# Altium schematic sheet Titanium_v0.1.SchDoc
size A3
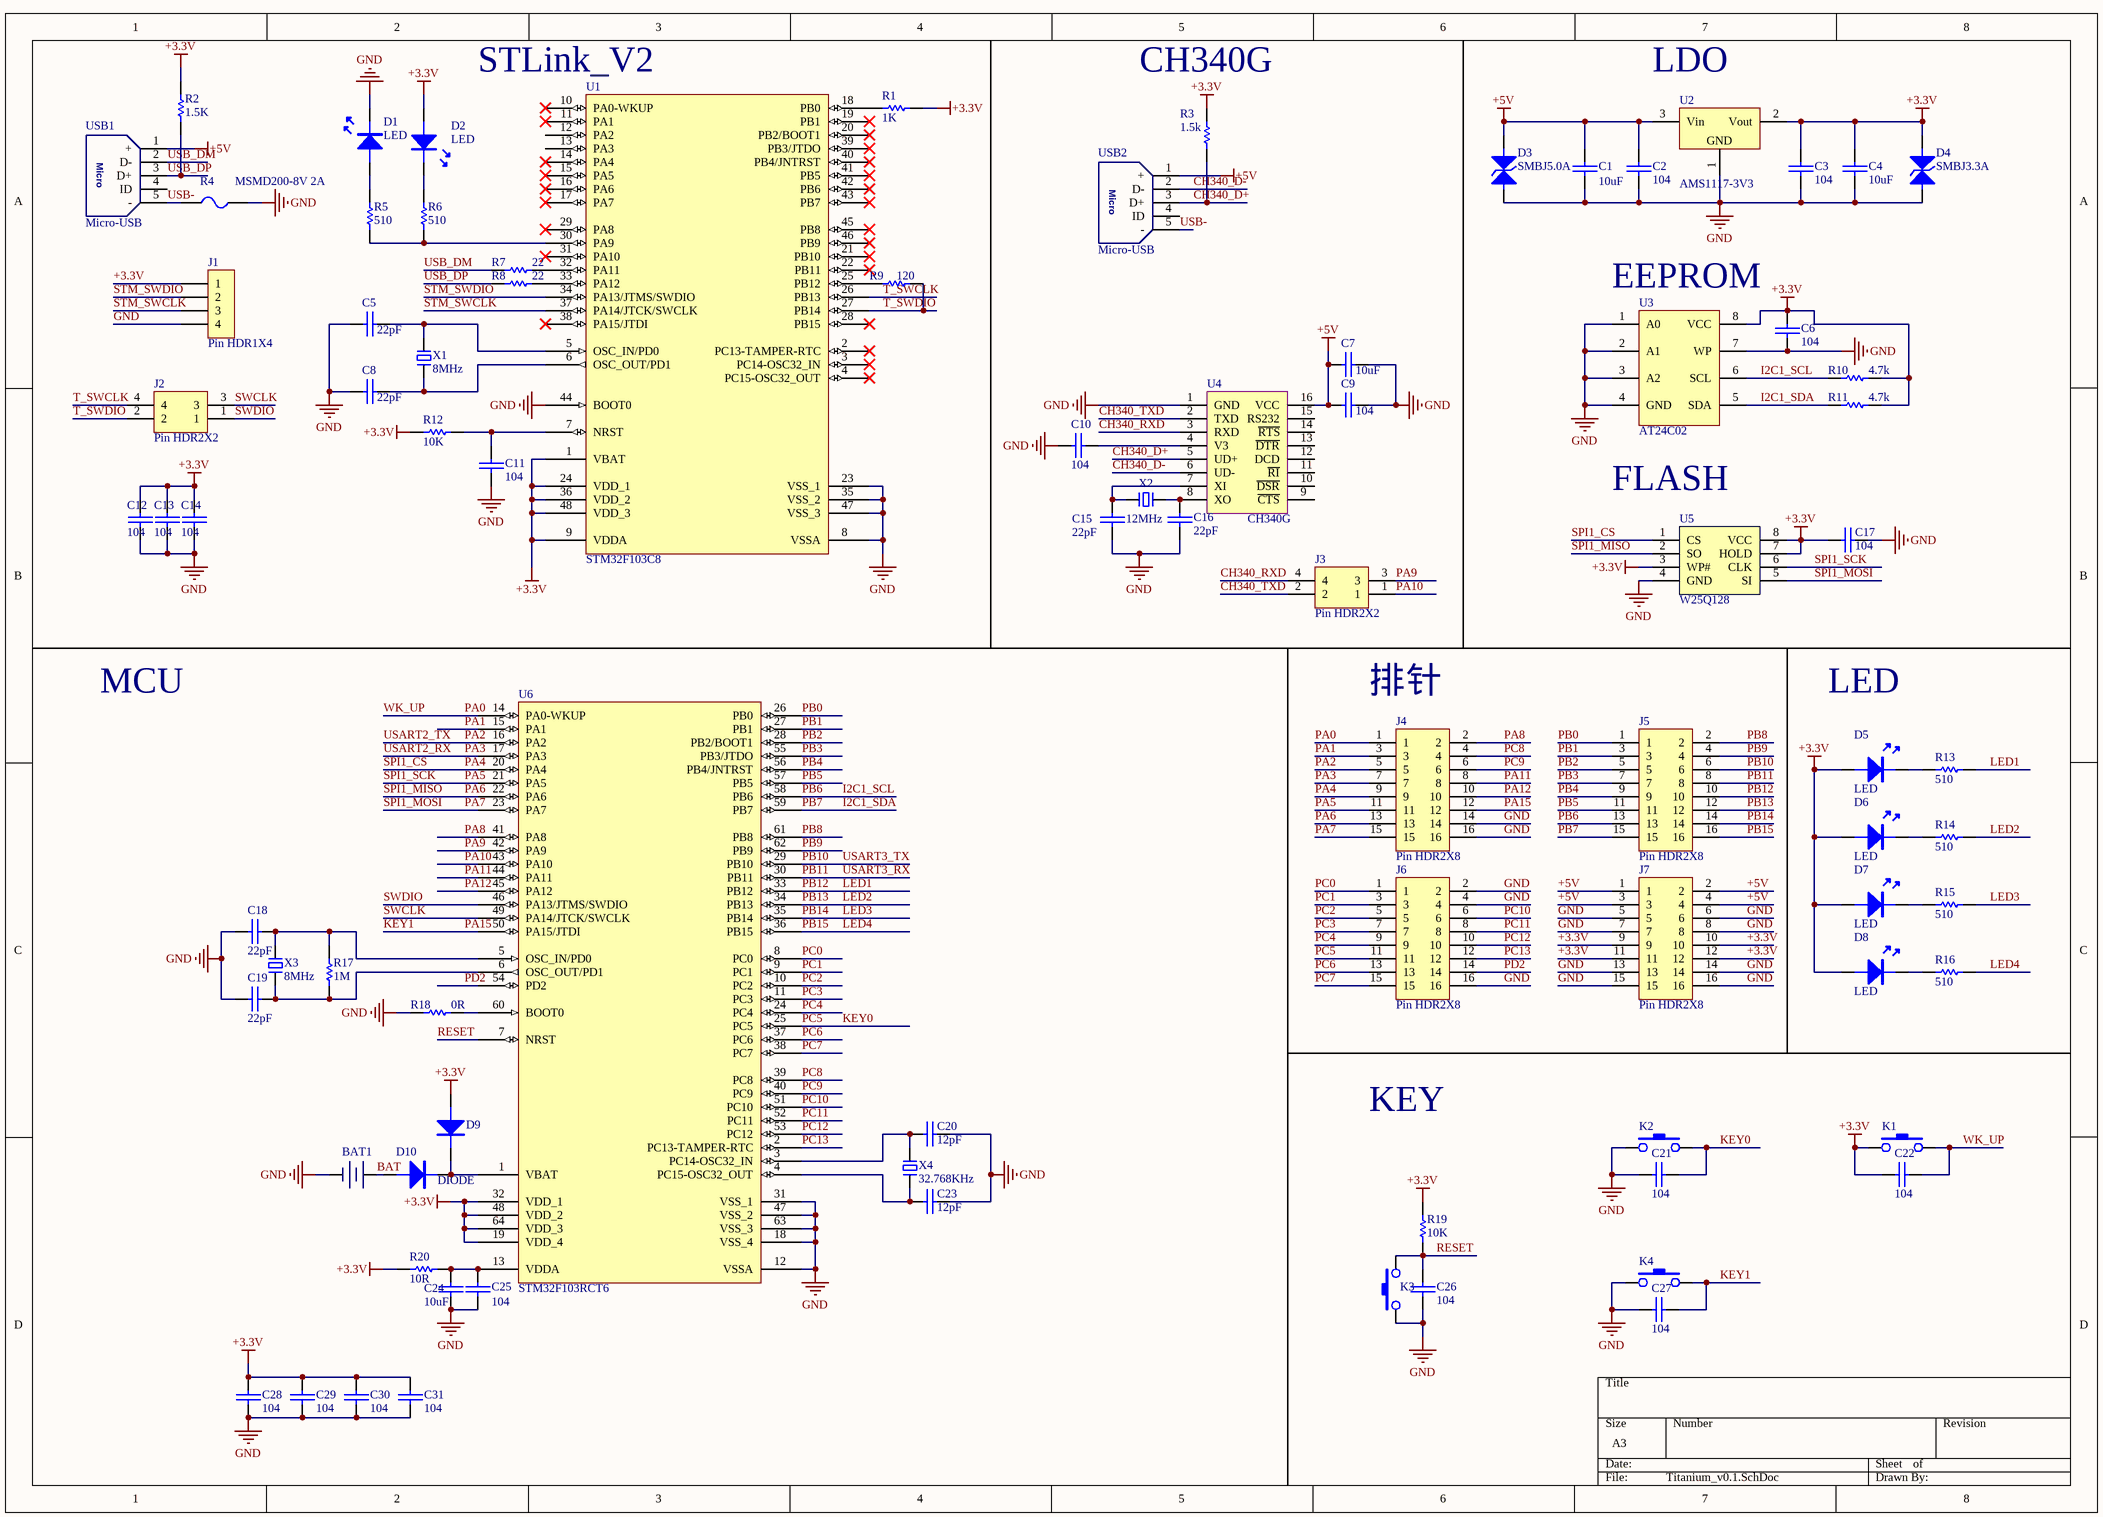
[diagram p0: Titanium_v0.1.SchDoc]

## Parts
BAT1  CR1220  [CR1220-A]  (value not drawn)
C1  10uF  [1210C]
C2  104  [0603C]
C3  104  [0603C]
C4  10uF  [1210C]
C5  22pF  [0603C]
C6  104  [0603C]
C7  10uF  [0603C]
C8  22pF  [0603C]
C9  104  [0603C]
C10  104  [0603C]
C11  104  [0603C]
C12  104  [0603C]
C13  104  [0603C]
C14  104  [0603C]
C15  22pF  [0603C]
C16  22pF  [0603C]
C17  104  [0603C]
C18  22pF  [0603C]
C19  22pF  [0603C]
C20  12pF  [0603C]
C21  104  [0603C]
C22  104  [0603C]
C23  12pF  [0603C]
C24  10uF  [0603C]
C25  104  [0603C]
C26  104  [0603C]
C27  104  [0603C]
C28  104  [0603C]
C29  104  [0603C]
C30  104  [0603C]
C31  104  [0603C]
D1  LED  [LED-0603B]
D2  LED  [LED-0603B]
D3  SMBJ5.0A  [SMB/DO-214AA]
D4  SMBJ3.3A  [SMB/DO-214AA]
D5  LED  [LED-0603B]
D6  LED  [LED-0603B]
D7  LED  [LED-0603B]
D8  LED  [LED-0603B]
D9  DIODE  [LL34]  (value not drawn)
D10  DIODE  [LL34]
J1  Pin HDR1X4  [Pin HDR1X4/2.54mm-S]
J2  Pin HDR2X2  [Pin HDR2X2/2.54mm-S]
J3  Pin HDR2X2  [Pin HDR2X2/2.54mm-S]
J4  Pin HDR2X8  [Pin HDR2X8/2.54mm-S]
J5  Pin HDR2X8  [Pin HDR2X8/2.54mm-S]
J6  Pin HDR2X8  [Pin HDR2X8/2.54mm-S]
J7  Pin HDR2X8  [Pin HDR2X8/2.54mm-S]
K1  KEY  [DIP-6X6X5]  (value not drawn)
K2  KEY  [DIP-6X6X5]  (value not drawn)
K3  KEY  [DIP-6X6X5]  (value not drawn)
K4  KEY  [DIP-6X6X5]  (value not drawn)
R1  1K  [0603R]
R2  1.5K  [0603R]
R3  1.5k  [0603R]
R4  MSMD200-8V 2A  [0805R]
R5  510  [0603R]
R6  510  [0603R]
R7  22  [0603R]
R8  22  [0603R]
R9  120  [0603R]
R10  4.7k  [0603R]
R11  4.7k  [0603R]
R12  10K  [0603R]
R13  510  [0603R]
R14  510  [0603R]
R15  510  [0603R]
R16  510  [0603R]
R17  1M  [0603R]
R18  0R  [0603R]
R19  10K  [0603R]
R20  10R  [0603R]
U1  STM32F103C8  [LQFP48 7X7]
U2  AMS1117-3V3  [SOT89]
U3  AT24C02  [SOP8]
U4  CH340G  [SOP16]
U5  W25Q128  [SOIC8]
U6  STM32F103RCT6  [LQFP64 10x10]
USB1  Micro-USB  [USB-MICRO_A]
USB2  Micro-USB  [USB-MICRO_A]
X1  8MHz  [OSC 5032-2P]
X2  12MHz  [OSC HC-49SMD]
X3  8MHz  [OSC 5032-2P]
X4  32.768KHz  [OSC 3215-2P]

## Nets
+3.3V: C3.2 C4.2 C6.2 C12.1 C13.1 C14.1 C17.2 C22.1 C28.2 C29.2 C30.2 C31.2 D2.A D4.K D5.A D6.A D7.A D8.A D9.A J1.1 J7.9 J7.10 J7.11 J7.12 K1.1 R1.2 R2.2 R3.1 R10.2 R11.2 R12.1 R19.2 R20.1 U1.1(VBAT) U1.9(VDDA) U1.24(VDD_1) U1.36(VDD_2) U1.48(VDD_3) U2.2(Vout) U3.8(VCC) U5.3(WP#) U5.7(HOLD) U5.8(VCC) U6.19(VDD_4) U6.32(VDD_1) U6.48(VDD_2) U6.64(VDD_3)
+5V: C1.2 C2.2 C7.2 C9.2 D3.K J7.1 J7.2 J7.3 J7.4 U2.3(Vin) U4.16(VCC) USB1.1(+) USB2.1(+)
GND: BAT1.2 C1.1 C2.1 C3.1 C4.1 C5.2 C6.1 C7.1 C8.2 C9.1 C10.2 C11.2 C12.2 C13.2 C14.2 C15.1 C16.1 C17.1 C18.1 C19.1 C20.1 C21.1 C23.1 C24.1 C25.1 C26.1 C27.1 C28.1 C29.1 C30.1 C31.1 D1.K D3.A D4.A J1.4 J4.14 J4.16 J6.2 J6.4 J6.16 J7.5 J7.6 J7.7 J7.8 J7.13 J7.14 J7.15 J7.16 K2.1 K3.1 K4.1 R4.2 R18.1 U1.8(VSSA) U1.23(VSS_1) U1.35(VSS_2) U1.44(BOOT0) U1.47(VSS_3) U2.1(GND) U3.1(A0) U3.2(A1) U3.3(A2) U3.4(GND) U3.7(WP) U4.1(GND) U5.4(GND) U6.12(VSSA) U6.18(VSS_4) U6.31(VSS_1) U6.47(VSS_2) U6.63(VSS_3)
BAT: BAT1.1 D10.A
CH340_D+: R3.2 U4.5(UD+) USB2.3(D+)
CH340_D-: U4.6(UD-) USB2.2(D-)
CH340_RXD: J3.4 U4.3(RXD)
CH340_TXD: J3.2 U4.2(TXD)
I2C1_SCL: J5.13 R10.1 U3.6(SCL) U6.58(PB6)  [also labelled PB6]
I2C1_SDA: J5.15 R11.1 U3.5(SDA) U6.59(PB7)  [also labelled PB7]
KEY0: C21.2 J6.11 K2.3 U6.25(PC5)  [also labelled PC5]
KEY1: C27.2 J4.12 K4.3 U6.50(PA15/JTDI)  [also labelled PA15]
LED1: J5.10 R13.2 U6.33(PB12)  [also labelled PB12]
LED2: J5.12 R14.2 U6.34(PB13)  [also labelled PB13]
LED3: J5.14 R15.2 U6.35(PB14)  [also labelled PB14]
LED4: J5.16 R16.2 U6.36(PB15)  [also labelled PB15]
PA0: C22.2 J4.1 K1.3 U6.14(PA0-WKUP)  [also labelled WK_UP]
PA1: J4.3 U6.15(PA1)
PA2: J4.5 U6.16(PA2)  [also labelled USART2_TX]
PA3: J4.7 U6.17(PA3)  [also labelled USART2_RX]
PA4: J4.9 U5.1(CS) U6.20(PA4)  [also labelled SPI1_CS]
PA5: J4.11 U5.6(CLK) U6.21(PA5)  [also labelled SPI1_SCK]
PA6: J4.13 U5.2(SO) U6.22(PA6)  [also labelled SPI1_MISO]
PA7: J4.15 U5.5(SI) U6.23(PA7)  [also labelled SPI1_MOSI]
PA8: J4.2 U6.41(PA8)
PA9: J3.3 U6.42(PA9)
PA10: J3.1 U6.43(PA10)
PA11: J4.8 U6.44(PA11)
PA12: J4.10 U6.45(PA12)
PB0: J5.1 U6.26(PB0)
PB1: J5.3 U6.27(PB1)
PB2: J5.5 U6.28(PB2/BOOT1)
PB3: J5.7 U6.55(PB3/JTDO)
PB4: J5.9 U6.56(PB4/JNTRST)
PB5: J5.11 U6.57(PB5)
PB8: J5.2 U6.61(PB8)
PB9: J5.4 U6.62(PB9)
PB10: J5.6 U6.29(PB10)  [also labelled USART3_TX]
PB11: J5.8 U6.30(PB11)  [also labelled USART3_RX]
PC0: J6.1 U6.8(PC0)
PC1: J6.3 U6.9(PC1)
PC2: J6.5 U6.10(PC2)
PC3: J6.7 U6.11(PC3)
PC4: J6.9 U6.24(PC4)
PC6: J6.13 U6.37(PC6)
PC7: J6.15 U6.38(PC7)
PC8: J4.4 U6.39(PC8)
PC9: J4.6 U6.40(PC9)
PC10: J6.6 U6.51(PC10)
PC11: J6.8 U6.52(PC11)
PC12: J6.10 U6.53(PC12)
PC13: J6.12 U6.2(PC13-TAMPER-RTC)
PD2: J6.14 U6.54(PD2)
RESET: C26.2 K3.3 R19.1 U6.7(NRST)
STM_SWCLK: J1.3 U1.37(PA14/JTCK/SWCLK)
STM_SWDIO: J1.2 U1.34(PA13/JTMS/SWDIO)
SWCLK: J2.3 U6.49(PA14/JTCK/SWCLK)
SWDIO: J2.1 U6.46(PA13/JTMS/SWDIO)
T_SWCLK: J2.4 U1.26(PB13)
T_SWDIO: J2.2 R9.2 U1.27(PB14)
USB-: R4.1 USB1.5(-) USB2.5(-)
USB_DM: R7.1 USB1.2(D-)
USB_DP: R2.1 R8.1 USB1.3(D+)
NetC5_1: C5.1 U1.5(OSC_IN/PD0) X1.2
NetC8_1: C8.1 U1.6(OSC_OUT/PD1) X1.1
NetC10_1: C10.1 U4.4(V3)
NetC11_1: C11.1 R12.2 U1.7(NRST)
NetC15_2: C15.2 U4.7(XI) X2.2
NetC16_2: C16.2 U4.8(XO) X2.1
NetC18_2: C18.2 R17.2 U6.5(OSC_IN/PD0) X3.2
NetC19_2: C19.2 R17.1 U6.6(OSC_OUT/PD1) X3.1
NetC20_2: C20.2 U6.3(PC14-OSC32_IN) X4.1
NetC23_2: C23.2 U6.4(PC15-OSC32_OUT) X4.2
NetC24_2: C24.2 C25.2 R20.2 U6.13(VDDA)
NetD1_A: D1.A R5.2
NetD2_K: D2.K R6.2
NetD5_K: D5.K R13.1
NetD6_K: D6.K R14.1
NetD7_K: D7.K R15.1
NetD8_K: D8.K R16.1
NetD9_K: D9.K D10.K U6.1(VBAT)
NetR1_1: R1.1 U1.18(PB0)
NetR5_1: R5.1 R6.1 U1.30(PA9)
NetR7_2: R7.2 U1.32(PA11)
NetR8_2: R8.2 U1.33(PA12)
NetR9_1: R9.1 U1.25(PB12)
NetR18_2: R18.2 U6.60(BOOT0)

Not connected (* = marked no-connect by the designer): U1 2(PC13-TAMPER-RTC)* 3(PC14-OSC32_IN)* 4(PC15-OSC32_OUT)* 10(PA0-WKUP)* 11(PA1)* 12(PA2) 13(PA3) 14(PA4)* 15(PA5)* 16(PA6)* 17(PA7)* 19(PB1)* 20(PB2/BOOT1)* 21(PB10)* 22(PB11)* 28(PB15)* 29(PA8)* 31(PA10)* 38(PA15/JTDI)* 39(PB3/JTDO)* 40(PB4/JNTRST)* 41(PB5)* 42(PB6)* 43(PB7)* 45(PB8)* 46(PB9)*; U4 9(~{CTS}) 10(~{DSR}) 11(~{RI}) 12(DCD) 13(~{DTR}) 14(~{RTS}) 15(RS232); USB1 4(ID); USB2 4(ID)

## Notes on the sheet
- (near U1) STLink_V2
- (near R3) CH340G
- (near U2) LDO
- (near U3) EEPROM
- FLASH
- MCU
- (near J4) 排针
- LED
- KEY
- (in symbol Micro-USB) Micro

## Library data of the parts
C1-C31 = CAP: 无极性电容
D3 D4 = TVS: 双向瞬态抑制二极管
D9 D10 = DIODE: 普通二极管
R1-R3 R5-R20 = RES
R4 = FU: 贴片保险丝; 版权归属: 源创客; BOM名称: 贴片保险丝; 学习资源: www.ooocke.com
U1 = STM32F103C8: Flaah:64/RAM:20/IO:36; BOM名称: 32位STM单片机; 版权归属: 源创客; 学习资源: www.ooocke.com
U2 = AMS1117: 三端稳压芯片; BOM名称: 稳压芯片; 版权归属: 源创客; 学习资源: www.ooocke.com
X1-X4 = XTAL-2P: 2脚无源脚晶振; 版权归属: 源创客; BOM名称: 2脚无源脚晶振; 学习资源: www.ooocke.com